# EasyEDA Pro project LeTian-robot2（轮腿机器人）.eprj, board Power-PCB
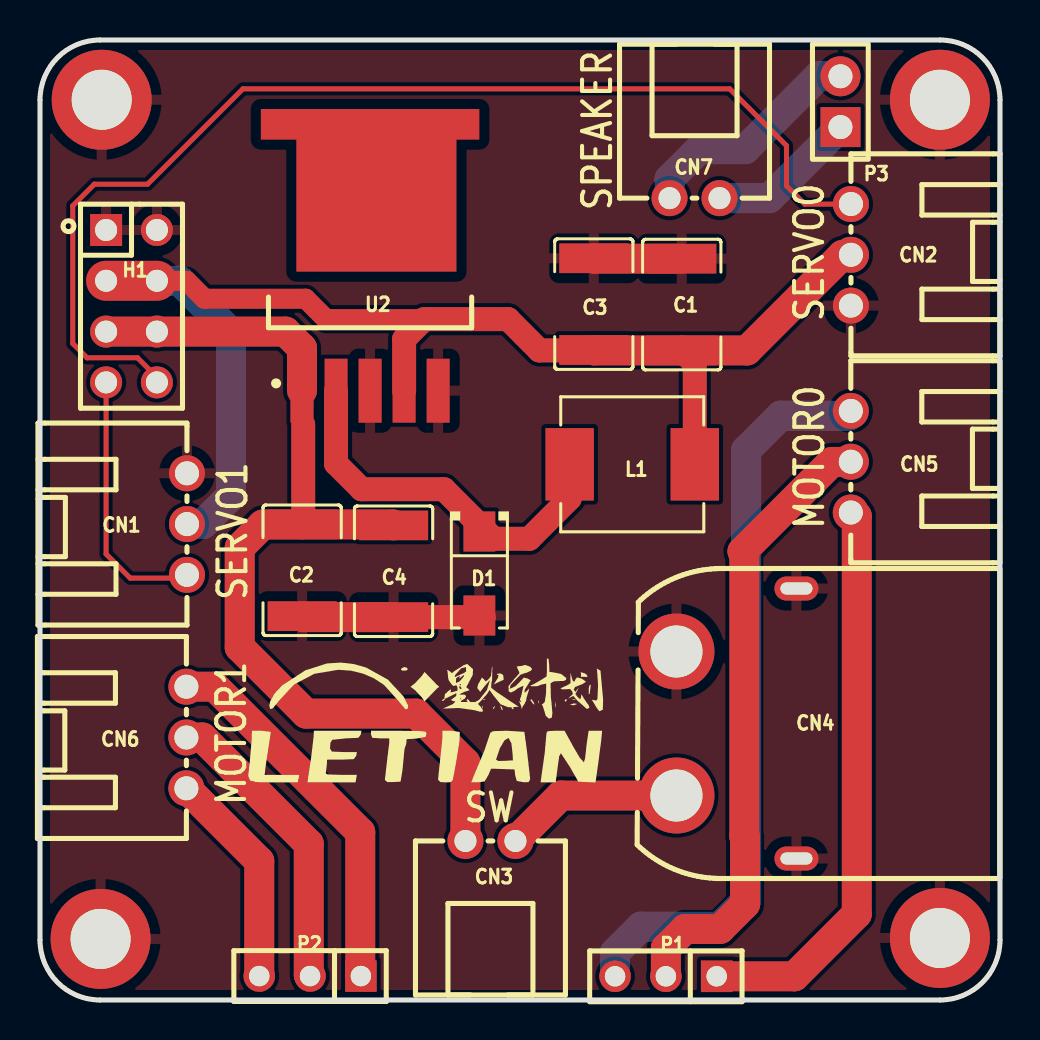
[diagram p6: board, top side]
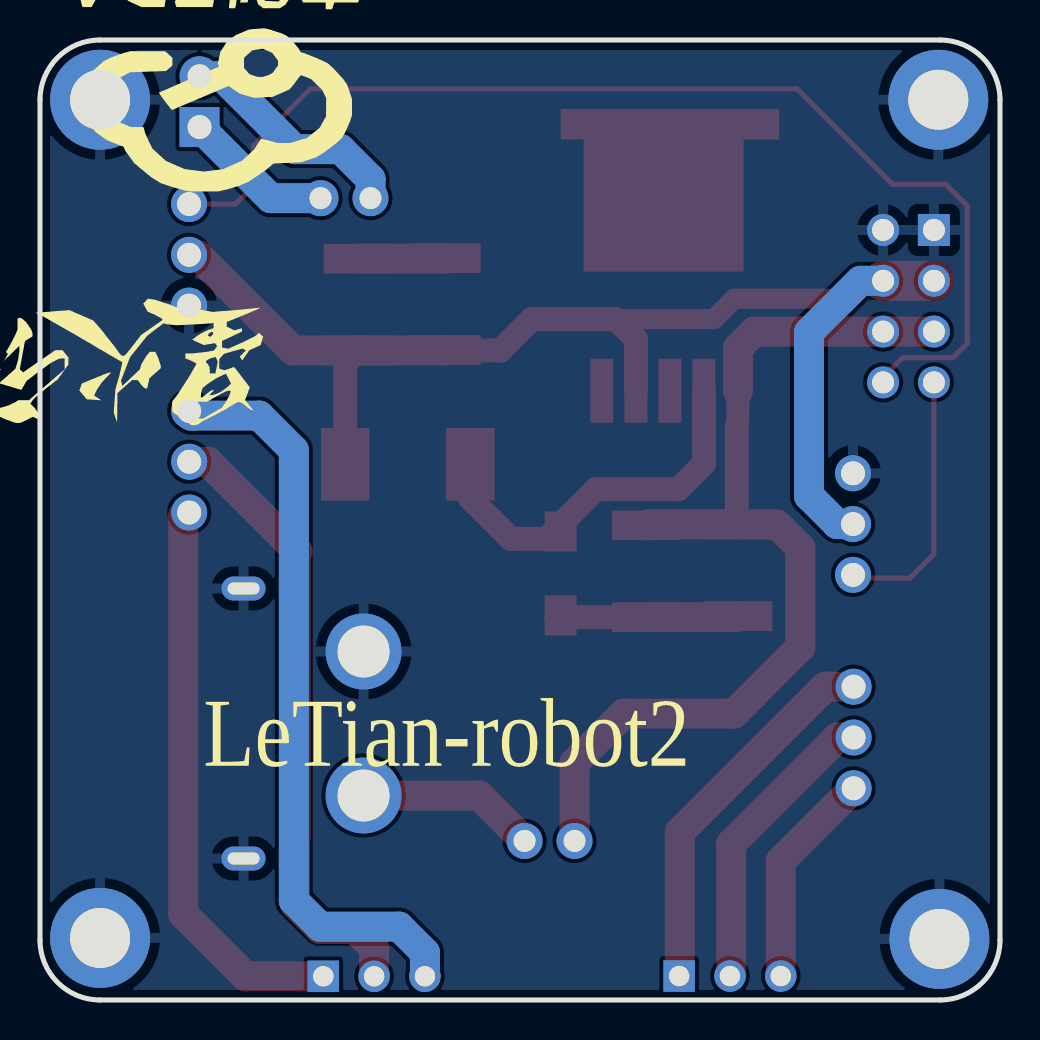
[diagram p7: board, bottom side, seen from below]

Outline 48 x 48 mm; copper layers: Top Layer, Bottom Layer. Coordinates in mm from the lower left corner of the outline.
Outline path: 0,45 arc(0.88,47.12) 3,48 45,48 arc(47.12,47.12) 48,45 48,3 arc(47.12,0.88) 45,0 3,0 arc(0.88,0.88) 0,3 0,45
Stack: Top Layer 0.035mm / Dielectric1 1.51mm FR4 er 4.5 / Bottom Layer 0.035mm

## Design rules (mm)
spacing safeClearance (default): track to track 0.152, other pairs 0.152 to 0.3
track width trackWidth (default): min 0.127, default 0.254, max 2.54
differential pair differentialPair (default): width min 0.127, default 0.254, max 2.54; gap min 0.152, default 0.152
via viaSize (default): diameter min 0.5, default 0.61, max 10; hole min 0.3, default 0.305, max 6

## Placement (name value [footprint] x y rotation side)
C1  10uF  [C1812]  32.09 34.77 270 top
C2  10uF  [C1812]  13.11 21.49 90 top
C3  10uF  [C1812]  27.69 34.79 270 top
C4  10uF  [C1812]  17.68 21.44 90 top
CN1  M2501R-03P  [CONN-TH_3P-P2.50_M2501R-03P]  7.35 23.8 270 top
CN2  M2501R-03P  [CONN-TH_3P-P2.50_M2501R-03P]  40.55 37.26 90 top
CN3  HX25003-2WAP  [CONN-TH_2P-P2.50_HX25003-2WAP]  22.52 7.95 0 top
CN4  XT60PW-M  [CONN-TH_XT60PW-M]  34.82 13.83 180 top
CN5  M2501R-03P  [CONN-TH_3P-P2.50_M2501R-03P]  40.54 26.91 90 top
CN6  M2501R-03P  [CONN-TH_3P-P2.50_M2501R-03P]  7.32 13.12 270 top
CN7  HX25003-2WAP  [CONN-TH_2P-P2.50_HX25003-2WAP]  32.73 40.09 180 top
D1  SS34AT  [SMA_L4.3-W2.5-LS5.0-RD]  21.97 21.33 270 top
H1  A2541HWV-2x4P  [HDR-TH_8P-P2.54-V-F-R2-C4-S2.54-1]  4.57 34.69 270 top
L1  33uH  [IND-SMD_L7.0-W6.6_FXL0630]  29.61 26.79 180 top
NOREF  -  [Pad_e1755]  45 3.1 0 top
NOREF#2  -  [Pad_e2045]  3.09 45.01 0 top
NOREF#3  -  [Pad_e1908]  45 45.01 0 top
NOREF#4  -  [Pad_e1577]  3.03 3.05 0 top
P1  2.54-1*3P母  [HDR-TH_3P-P2.54-V-F]  31.29 1.19 180 top
P2  2.54-1*3P母  [HDR-TH_3P-P2.54-V-F]  13.5 1.2 180 top
P3  2.54-1*2P母  [HDR-TH_2P-P2.54-V-F]  40.02 44.92 90 top
U2  LM2596SX-5.0/NOPB  [TO-263-5_L10.2-W8.9-P1.70-TL]  16.5 35.47 90 top

## Footprints (pads in the part's own frame, mm; a bottom-side part is the same pattern mirrored in y, then rotated)
C1812
  rect 1.486x3.457 smd: 1(-2.293,0) 2(2.293,0)
CONN-TH_2P-P2.50_HX25003-2WAP
  round 1.801 hole 1.1: 1(-1.25,0) 2(1.25,0)
CONN-TH_3P-P2.50_M2501R-03P
  round 1.801 hole 1.199: 1(-2.54,0) 2(0,0) 3(2.54,0)
CONN-TH_XT60PW-M
  round 3.8 hole 2.6: 1(3,-3.6) 2(3,3.6)
  oval 2.2x1.2 hole 1.6x0.6: 3(-3,6.75) 4(-3,-6.75)
HDR-TH_2P-P2.54-V-F
  rect 1.999x1.999 hole 1.199: 1(-1.27,0)
  round 1.999 hole 1.199: 2(1.27,0)
HDR-TH_3P-P2.54-V-F
  rect 1.575x1.575 hole 1.02: 1(-2.54,0)
  round 1.575 hole 1.02: 2(0,0) 3(2.54,0)
HDR-TH_8P-P2.54-V-F-R2-C4-S2.54-1
  rect 1.6x1.6 hole 1.1: 1(-3.81,-1.27)
  round 1.6 hole 1.1: 2(-3.81,1.27) 3(-1.27,-1.27) 4(-1.27,1.27) 5(1.27,-1.27) 6(1.27,1.27) 7(3.81,-1.27) 8(3.81,1.27)
IND-SMD_L7.0-W6.6_FXL0630
  rect 2.423x3.619 smd: 1(3.13,0) 2(-3.127,0)
Pad_e1577
  round 5 hole 3: 2(0,0)
Pad_e1755
  round 5 hole 3: 1(0,0)
Pad_e1908
  round 5 hole 3: 2(0,0)
Pad_e2045
  round 5 hole 3: 2(0,0)
SMA_L4.3-W2.5-LS5.0-RD
  rect 2x1.593 smd: 1(-2.1,0) 2(2.1,0)
TO-263-5_L10.2-W8.9-P1.70-TL
  rect 3.2x1.151 smd: 1(-5.009,3.404) 2(-5.009,1.702) 3(-5.009,0) 4(-5.009,-1.702) 5(-5.009,-3.404)
  custom 8.128x10.922 smd: 6(5.009,-0.318)

## Nets
As in the schematic, except:
GND: C1.1 C2.1 C3.1 C4.1 CN1.1 CN2.1 CN4.1 CN4.3 CN4.4 D1.2 H1.1 H1.2 NOREF.1 NOREF#2.2 NOREF#3.2 NOREF#4.2 U2.3 U2.5 U2.6

## Routing (per net, layer and track width the routed paths; a pad name or vN(x,y) marks a point on that pad's centre or on a via; arc(x,y) is an arc through that point)
5V: length 66.5
  Top Layer w1: 19.2,34.04 14.3,34.04 13.28,35.06 8.22,35.06 7.32,35.96 H1.4
  Top Layer w1.2: 27.71,32.48 24.97,32.48 23.41,34.04 19.2,34.04 18.21,33.04 U2.4 ; L1.2 32.74,31.83 C1.2
  Top Layer w1.5: 40.68,37.25 40.13,37.25 35.35,32.48 C1.2 27.71,32.48 C3.2
  Top Layer w2: H1.3 H1.4
  Bottom Layer w1.5: H1.4 6.97,35.96 9.55,33.39 9.55,25.2 8.14,23.8 CN1.2
GND: length 13.5
  Top Layer w1.2: C4.1 22.19,19.14
  Top Layer w1.5: C4.1 13.16,19.14 C2.1 ; C3.1 27.71,37.07 C1.1
V0-O: length 18.9
  Top Layer w1.5: CN6.1 8.74,15.67 16.01,8.39 16.01,1.23 P2.1
V1-O: length 37.5
  Bottom Layer w1.5: P1.3 28.75,2.38 30.05,3.67 34,3.67 35.31,4.98 35.31,27.49 37.03,29.22 40.45,29.22 40.67,29.44
VCC: length 48
  Top Layer w1.2: 13.16,28.77 13.16,23.83 C2.2
  Top Layer w1.5: C4.2 17.63,23.78 C2.2 11.14,23.78 ; CN3.1 21.27,11.86 18.81,14.32 13.3,14.32 9.99,17.64 9.99,22.62 11.08,23.72 ; U2.1 13.1,32.6 12.28,33.42 H1.6 H1.5
VIN: length 9
  Top Layer w1.5: CN4.2 26.04,10.23 CN3.2
SERVO0: length 57.1
  Top Layer w0.254: H1.8 5.84,31.14 4.88,32.11 2.35,32.11 1.64,32.83 1.64,39.71 2.72,40.79 5.38,40.79 10.15,45.56 34.48,45.56 37.32,42.72 37.32,40.71 38.24,39.79 40.68,39.79
SERVO1: length 13.2
  Top Layer w0.254: H1.7 3.31,22.3 4.51,21.09 7.19,21.09 CN1.3
SPEAKER_N: length 11.6
  Bottom Layer w1.5: CN7.2 31.48,41.05 32.97,42.54 35.27,42.54 38.91,46.19 P3.2
SPEAKER_P: length 7.5
  Bottom Layer w1.5: CN7.1 36.47,40.09 P3.1
U0-O: length 10.9
  Top Layer w1.5: CN6.3 10.96,6.94 P2.3
U1-O: length 28.4
  Top Layer w1.5: 33.83,1.19 37.72,1.19 40.84,4.3 40.84,24.2 40.67,24.36
W0: length 15
  Top Layer w1.5: P2.2 13.44,1.26 13.44,7.81 8.12,13.12 CN6.2
W1: length 31.4
  Top Layer w1.5: 40.67,26.9 39.6,26.9 35.12,22.43 35.22,22.34 35.22,8.19 35.25,8.15 35.25,4.8 34.01,3.55 32.26,3.55 31.29,2.59 P1.2
$1N1222: length 19.4
  Top Layer w1.2: U2.2 14.8,26.82 16.08,25.54 20.2,25.54 22.68,23.06 24.47,23.06 26.48,25.08 L1.1

## Copper pours and planes (outline as drawn; the poured copper is in the pictures)
GND on Top Layer: -0.05,47.95 47.96,47.95 47.96,-0.06 -0.05,-0.06
GND on Bottom Layer: -0.57,48.35 48.17,48.35 48.17,-0.3 -0.57,-0.3

## Text on the board
Bottom Silkscreen Layer: LeTian-robot2
Top Silkscreen Layer: MOTOR1 | SERVO1 | SPEAKER | SERVO0 | MOTOR0 | SW
